# Altium project CarteDétéction.PrjPCB
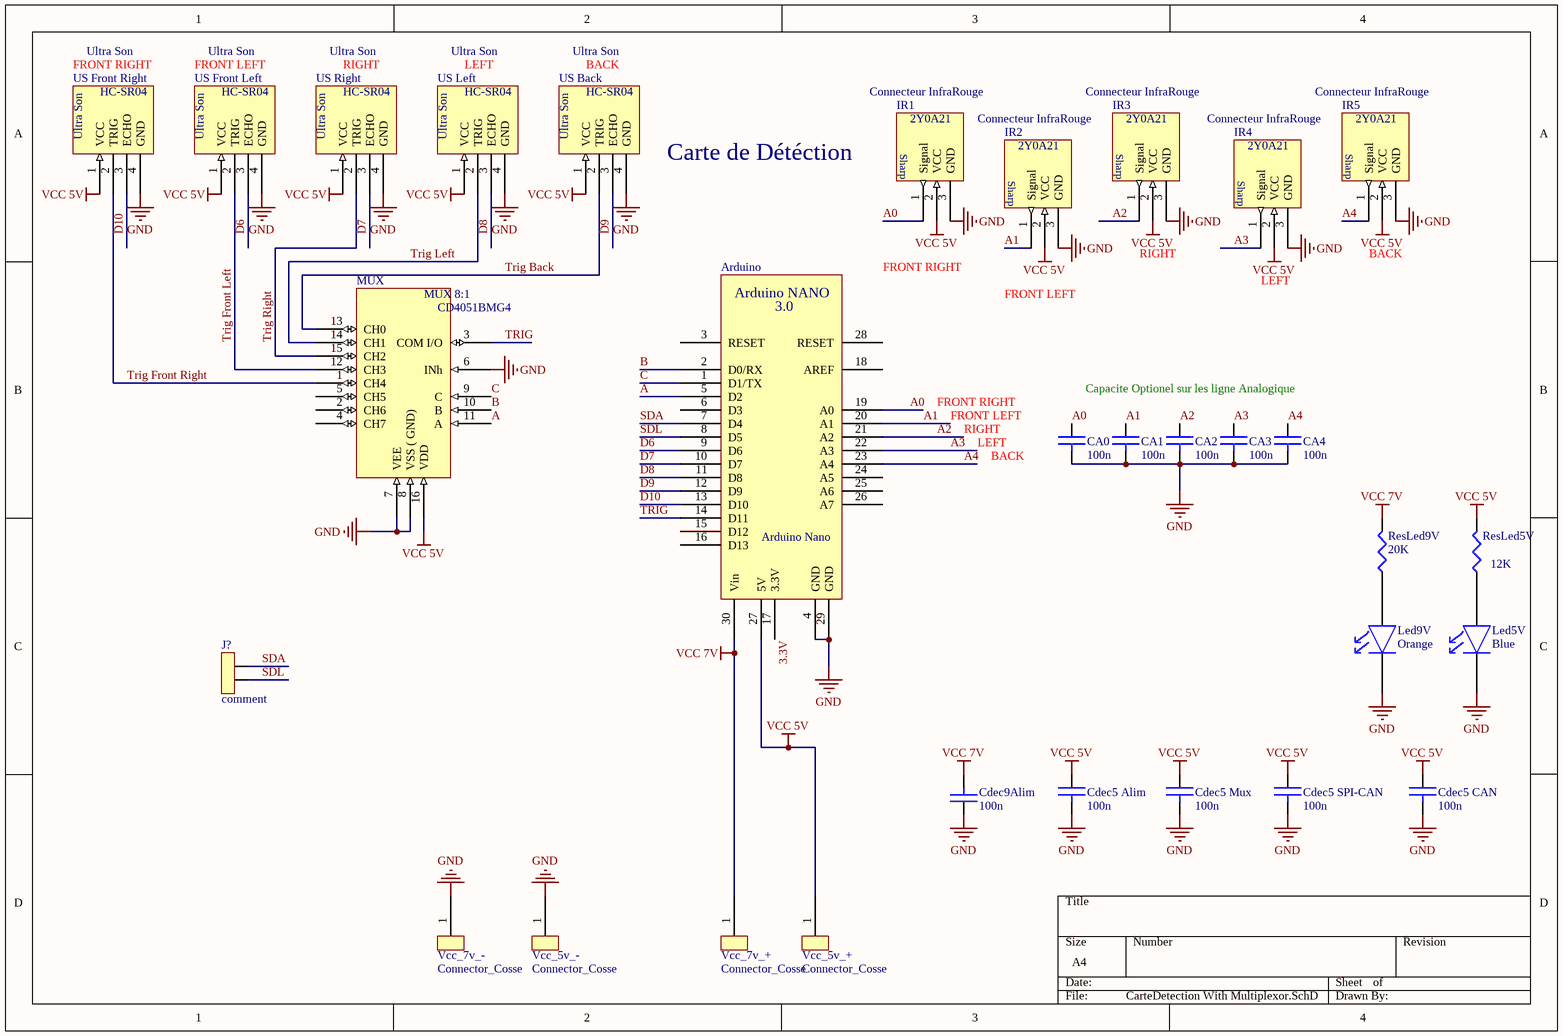
[diagram p0: CarteDetection With Multiplexor.SchDoc]
1 sheet, 31 parts. Net scope: global (net labels, ports and power ports of the same name join across sheets).
Board file: PCB Carte détéction Sans Ecriture.PCBDOC

## Sheet CarteDetection With Multiplexor.SchDoc
size A4; PageSetup: Record=PageOptions|CenterHorizontal=True|CenterVertical=True|PrintScale=1.00|XCorrection=1.00|YCorrection=1.00|PrintKind=0|BorderSize=5000000|LeftOffset=0|BottomOffset=0|Orientation=2|PaperLength=1000|PaperWidth=1000|Scale=100|PaperSource=15|PrintQuality=600|MediaType=1|DitherType=1|PaperKind=A4|PrintScaleMode=1

### Parts
Arduino  Arduino Nano  [Arduino Nano FootPrint]
CA0  value 100n  [0805]  (hidden comment: CAP)
CA1  value 100n  [0805]  (hidden comment: CAP)
CA2  value 100n  [0805]  (hidden comment: CAP)
CA3  value 100n  [0805]  (hidden comment: CAP)
CA4  value 100n  [0805]  (hidden comment: CAP)
Cdec5_Alim  value 100n  [0805]  (hidden comment: CAP)
Cdec5_CAN  value 100n  [0805]  (hidden comment: CAP)
Cdec5_Mux  value 100n  [0805]  (hidden comment: CAP)
Cdec5_SPI-CAN  value 100n  [0805]  (hidden comment: CAP)
Cdec9Alim  value 100n  [0805]  (hidden comment: CAP)
IR1  Connecteur InfraRouge  [Connecteur InfraRouge]
IR2  Connecteur InfraRouge  [Connecteur InfraRouge]
IR3  Connecteur InfraRouge  [Connecteur InfraRouge]
IR4  Connecteur InfraRouge  [Connecteur InfraRouge]
IR5  Connecteur InfraRouge  [Connecteur InfraRouge]
J?  comment  [AMP_2]
Led5V  Blue  [LED5]
Led9V  Orange  [LED5]
MUX  MUX 8:1 CD4051B  [MUX 8:1*]  (value not drawn)
ResLed5V  value 12K  [0805]  (hidden comment: RES)
ResLed9V  value 20K  [0805]  (hidden comment: RES)
US_Back  Ultra Son  [Conecteur UltraSon]
US_Front_Left  Ultra Son  [Conecteur UltraSon]
US_Front_Right  Ultra Son  [Conecteur UltraSon]
US_Left  Ultra Son  [Conecteur UltraSon]
US_Right  Ultra Son  [Conecteur UltraSon]
Vcc_5v_+  Connector_Cosse  [Connector_Cosse]
Vcc_5v_-  Connector_Cosse  [Connector_Cosse]
Vcc_7v_+  Connector_Cosse  [Connector_Cosse]
Vcc_7v_-  Connector_Cosse  [Connector_Cosse]

### Nets
GND: Arduino.4(GND) Arduino.29(GND) CA0.2 CA1.2 CA2.2 CA3.2 CA4.2 Cdec5_Alim.2 Cdec5_CAN.2 Cdec5_Mux.2 Cdec5_SPI-CAN.2 Cdec9Alim.1 IR1.3(GND) IR2.3(GND) IR3.3(GND) IR4.3(GND) IR5.3(GND) Led5V.K Led9V.K MUX.6(INh) MUX.7(VEE) MUX.8(VSS_(_GND)) US_Back.4(GND) US_Front_Left.4(GND) US_Front_Right.4(GND) US_Left.4(GND) US_Right.4(GND) Vcc_5v_-.1 Vcc_7v_-.1
VCC 5V: Arduino.27(5V) Cdec5_Alim.1 Cdec5_CAN.1 Cdec5_Mux.1 Cdec5_SPI-CAN.1 IR1.2(VCC) IR2.2(VCC) IR3.2(VCC) IR4.2(VCC) IR5.2(VCC) MUX.16(VDD) ResLed5V.2 US_Back.1(VCC) US_Front_Left.1(VCC) US_Front_Right.1(VCC) US_Left.1(VCC) US_Right.1(VCC) Vcc_5v_+.1
VCC 7V: Arduino.30(Vin) Cdec9Alim.2 ResLed9V.2 Vcc_7v_+.1
3.3V: Arduino.17(3.3V)
A: Arduino.5(D2) MUX.11(A)
A0: Arduino.19(A0) CA0.1 IR1.1(Signal)
A1: Arduino.20(A1) CA1.1 IR2.1(Signal)
A2: Arduino.21(A2) CA2.1 IR3.1(Signal)
A3: Arduino.22(A3) CA3.1 IR4.1(Signal)
A4: Arduino.23(A4) CA4.1 IR5.1(Signal)
B: Arduino.2(D0/RX) MUX.10(B)
C: Arduino.1(D1/TX) MUX.9(C)
D6: Arduino.9(D6) US_Front_Left.3(ECHO)
D7: Arduino.10(D7) US_Right.3(ECHO)
D8: Arduino.11(D8) US_Left.3(ECHO)
D9: Arduino.12(D9) US_Back.3(ECHO)
D10: Arduino.13(D10) US_Front_Right.3(ECHO)
SDA: Arduino.7(D4) J?.1
SDL: Arduino.8(D5) J?.2
TRIG: Arduino.14(D11) MUX.3(COM_I/O)
Trig Back: MUX.13(CH0) US_Back.2(TRIG)
Trig Front Left: MUX.12(CH3) US_Front_Left.2(TRIG)
Trig Front Right: MUX.1(CH4) US_Front_Right.2(TRIG)
Trig Left: MUX.14(CH1) US_Left.2(TRIG)
Trig Right: MUX.15(CH2) US_Right.2(TRIG)
NetLed5V_A: Led5V.A ResLed5V.1
NetLed9V_A: Led9V.A ResLed9V.1

Not connected (* = marked no-connect by the designer): Arduino 3(RESET) 6(D3) 15(D12) 16(D13) 18(AREF) 24(A5) 25(A6) 26(A7) 28(RESET); MUX 2(CH6) 4(CH7) 5(CH5)

### Notes on the sheet
- FRONT RIGHT
- FRONT LEFT
- RIGHT
- LEFT
- BACK
- Carte de Détéction
- Capacite Optionel sur les ligne Analogique
- (in symbol Arduino Nano) Arduino NANO; 3.0
- (in symbol Connecteur InfraRouge) 2Y0A21; Sharp
- (in symbol MUX 8:1 CD4051B) MUX 8:1; CD4051BMG4
- (in symbol Ultra Son) HC-SR04

### Library data of the parts
CA0-CA4 Cdec5_Alim Cdec5_CAN Cdec5_Mux Cdec5_SPI-CAN Cdec9Alim = CAP: capacité non polarisée
J? = POWER2: connecteur alim 2 pôles
Led5V Led9V = LED: LED 5mm/3mm/CMS
ResLed5V ResLed9V = RES: resistance